# Altium schematic sheet sheet2.SchDoc
size A4
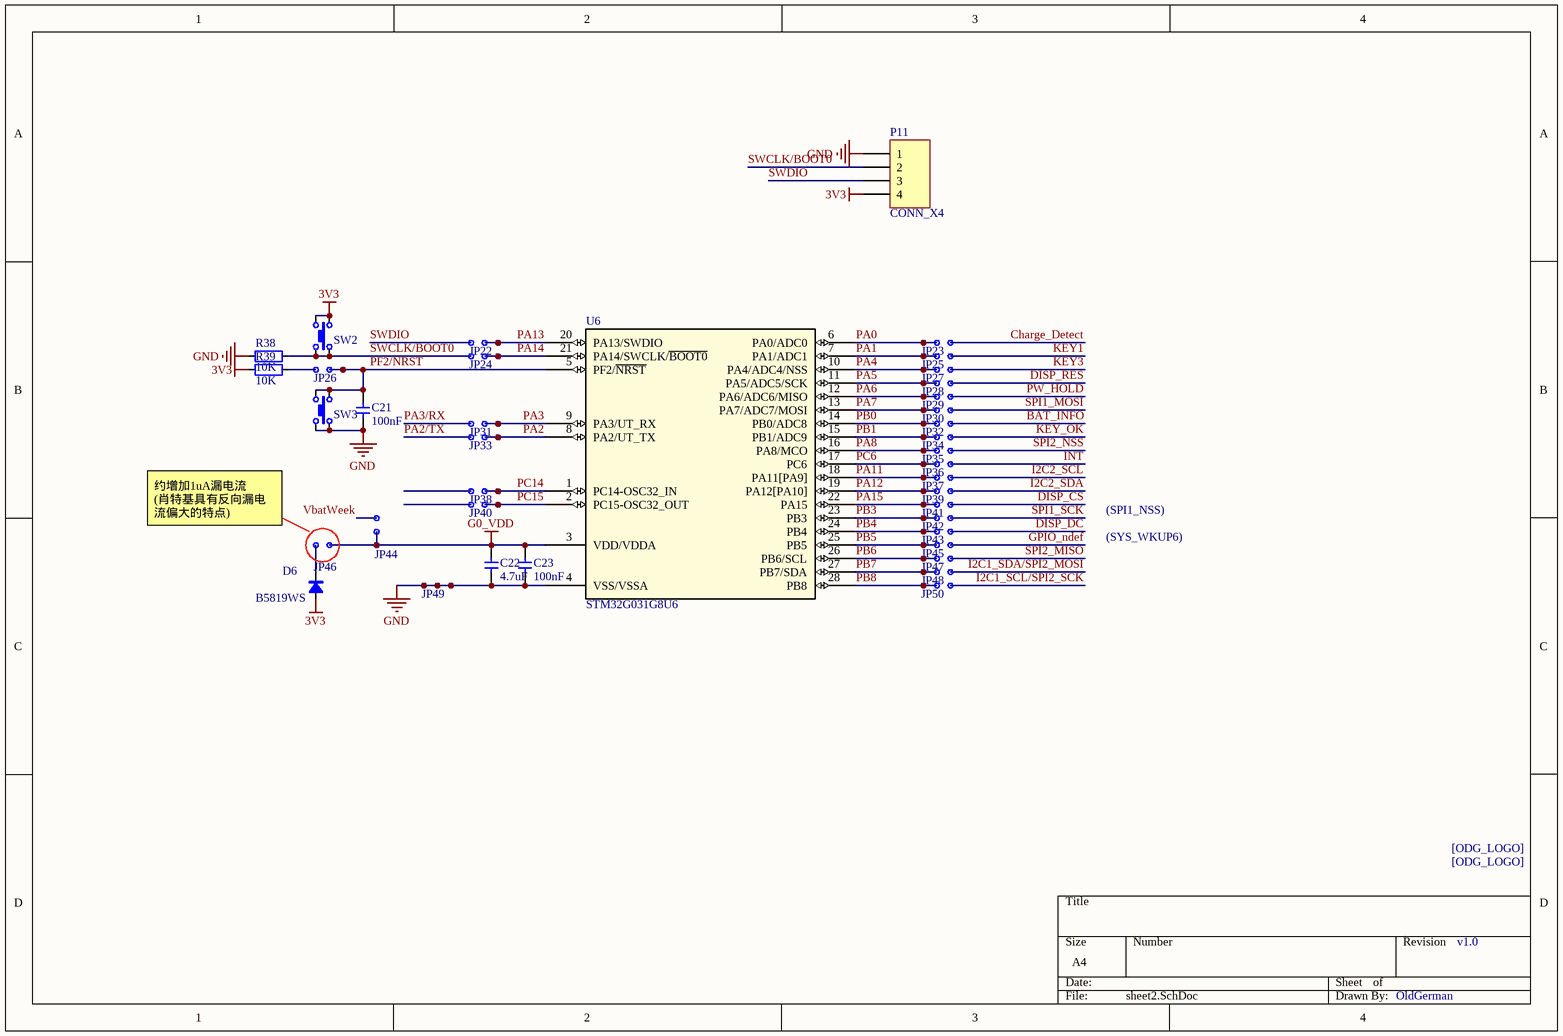
[diagram p0: sheet2.SchDoc]

## Parts
C21  100nF  [C0603]
C22  4.7uF  [C0603]
C23  100nF  [C0603]
D6  B5819WS  [SOD-323]
JP22  CONN_X3_DOT  [2.54mm_Male_x3]  (value not drawn)
JP23  CONN_X3_DOT  [2.54mm_Male_x3]  (value not drawn)
JP24  CONN_X3_DOT  [2.54mm_Male_x3]  (value not drawn)
JP25  CONN_X3_DOT  [2.54mm_Male_x3]  (value not drawn)
JP26  CONN_X3_DOT  [2.54mm_Male_x3]  (value not drawn)
JP27  CONN_X3_DOT  [2.54mm_Male_x3]  (value not drawn)
JP28  CONN_X3_DOT  [2.54mm_Male_x3]  (value not drawn)
JP29  CONN_X3_DOT  [2.54mm_Male_x3]  (value not drawn)
JP30  CONN_X3_DOT  [2.54mm_Male_x3]  (value not drawn)
JP31  CONN_X3_DOT  [2.54mm_Male_x3]  (value not drawn)
JP32  CONN_X3_DOT  [2.54mm_Male_x3]  (value not drawn)
JP33  CONN_X3_DOT  [2.54mm_Male_x3]  (value not drawn)
JP34  CONN_X3_DOT  [2.54mm_Male_x3]  (value not drawn)
JP35  CONN_X3_DOT  [2.54mm_Male_x3]  (value not drawn)
JP36  CONN_X3_DOT  [2.54mm_Male_x3]  (value not drawn)
JP37  CONN_X3_DOT  [2.54mm_Male_x3]  (value not drawn)
JP38  CONN_X3_DOT  [2.54mm_Male_x3]  (value not drawn)
JP39  CONN_X3_DOT  [2.54mm_Male_x3]  (value not drawn)
JP40  CONN_X3_DOT  [2.54mm_Male_x3]  (value not drawn)
JP41  CONN_X3_DOT  [2.54mm_Male_x3]  (value not drawn)
JP42  CONN_X3_DOT  [2.54mm_Male_x3]  (value not drawn)
JP43  CONN_X3_DOT  [2.54mm_Male_x3]  (value not drawn)
JP44  CONN_X3_DOT  [2.54mm_Male_x3]  (value not drawn)
JP45  CONN_X3_DOT  [2.54mm_Male_x3]  (value not drawn)
JP46  CONN_X2_DOT  [2.54mm_Male_x2]  (value not drawn)
JP47  CONN_X3_DOT  [2.54mm_Male_x3]  (value not drawn)
JP48  CONN_X3_DOT  [2.54mm_Male_x3]  (value not drawn)
JP49  CONN_X3_DOT  [2.54mm_Male_x3]  (value not drawn)
JP50  CONN_X3_DOT  [2.54mm_Male_x3]  (value not drawn)
ODG1  ODG_LOGO  [ODG_LOGO_soldermask]  (value not drawn)
ODG2  ODG_LOGO  [ODG_LOGO_soldermask]  (value not drawn)
P11  CONN_X4  [2.54mm_Male_x4]
R38  10K  [R0603]
R39  10K  [R0603]
SW2  Button-4P  [SWITCH_3X4X2.5_4PIN_SMD]  (value not drawn)
SW3  Button-4P  [SWITCH_3X4X2.5_4PIN_SMD]  (value not drawn)
U6  STM32G031G8U6  [UFQFPN28-4x4mm_ODG]

## Nets
3V3: D6.1(A) P11.4 R39.2 SW2.3 SW2.4
G0_VDD: C22.1 C23.1 JP44.2 JP44.3 JP46.1 U6.3(VDD/VDDA)
GND: C21.2 C22.2 C23.2 JP49.1 JP49.2 JP49.3 P11.1 R38.2 SW3.1 SW3.2 U6.4(VSS/VSSA)
BAT_INFO: JP32.3
Charge_Detect: JP23.3
DISP_CS: JP41.3
DISP_DC: JP43.3
DISP_RES: JP28.3
GPIO_ndef: JP45.3
I2C1_SCL/SPI2_SCK: JP50.3
I2C1_SDA/SPI2_MOSI: JP48.3
I2C2_SCL: JP37.3
I2C2_SDA: JP39.3
INT: JP36.3
KEY1: JP25.3
KEY3: JP27.3
KEY_OK: JP34.3
PA0: JP23.1 JP23.2 U6.6(PA0/ADC0)
PA1: JP25.1 JP25.2 U6.7(PA1/ADC1)
PA2: JP33.2 JP33.3 U6.8(PA2/UT_TX)
PA2/TX: JP33.1
PA3: JP31.2 JP31.3 U6.9(PA3/UT_RX)
PA3/RX: JP31.1
PA4: JP27.1 JP27.2 U6.10(PA4/ADC4/NSS)
PA5: JP28.1 JP28.2 U6.11(PA5/ADC5/SCK)
PA6: JP29.1 JP29.2 U6.12(PA6/ADC6/MISO)
PA7: JP30.1 JP30.2 U6.13(PA7/ADC7/MOSI)
PA8: JP35.1 JP35.2 U6.16(PA8/MCO)
PA11: JP37.1 JP37.2 U6.18(PA11[PA9])
PA12: JP39.1 JP39.2 U6.19(PA12[PA10])
PA13: JP22.2 JP22.3 U6.20(PA13/SWDIO)
PA14: JP24.2 JP24.3 U6.21(PA14/SWCLK/~{BOOT0})
PA15: JP41.1 JP41.2 U6.22(PA15)
PB0: JP32.1 JP32.2 U6.14(PB0/ADC8)
PB1: JP34.1 JP34.2 U6.15(PB1/ADC9)
PB3: JP42.1 JP42.2 U6.23(PB3)
PB4: JP43.1 JP43.2 U6.24(PB4)
PB5: JP45.1 JP45.2 U6.25(PB5)
PB6: JP47.1 JP47.2 U6.26(PB6/SCL)
PB7: JP48.1 JP48.2 U6.27(PB7/SDA)
PB8: JP50.1 JP50.2 U6.28(PB8)
PC6: JP36.1 JP36.2 U6.17(PC6)
PC14: JP38.2 JP38.3 U6.1(PC14-OSC32_IN)
PC15: JP40.2 JP40.3 U6.2(PC15-OSC32_OUT)
PF2/~{NRST}: C21.1 JP26.2 JP26.3 SW3.3 SW3.4 U6.5(PF2/~{NRST})
PW_HOLD: JP29.3
SPI1_MOSI: JP30.3
SPI1_SCK: JP42.3
SPI2_MISO: JP47.3
SPI2_NSS: JP35.3
SWCLK/BOOT0: JP24.1 P11.2 R38.1 SW2.1 SW2.2
SWDIO: JP22.1 P11.3
VbatWeek: JP44.1
NetD6_2: D6.2(C) JP46.2
NetJP26_1: JP26.1 R39.1

Not connected (* = marked no-connect by the designer): JP38 1; JP40 1

## Notes on the sheet
- 约增加1uA漏电流
  (肖特基具有反向漏电流偏大的特点)
- (SPI1_NSS)
- (SYS_WKUP6)
- v1.0
- OldGerman
- (in symbol ODG_LOGO) [ODG_LOGO]

## Library data of the parts
C21-C23 = CAP: Capacitor; Value: 0.1u
D6 = DIODE: 肖特基二极管
R38 R39 = RES: Resistor; Value: 22R
SW2 SW3 = Button-4P: Button
U6 = STM32G031G8U6: No Description Available; Mfr_Name: STMicroelectronics; Copyright: Copyright (C) 2022 Ultra Librarian. All rights reserved.; Manufacturer_Part_Number: STM32G031G8U6; RefDes: RefDes; Type: DEV